# Altium schematic sheet Sensors.SchDoc: Sensor Interfaces
size A4; DocumentNumber: 5; Revision: D; SheetNumber: 5; SheetTotal: 7
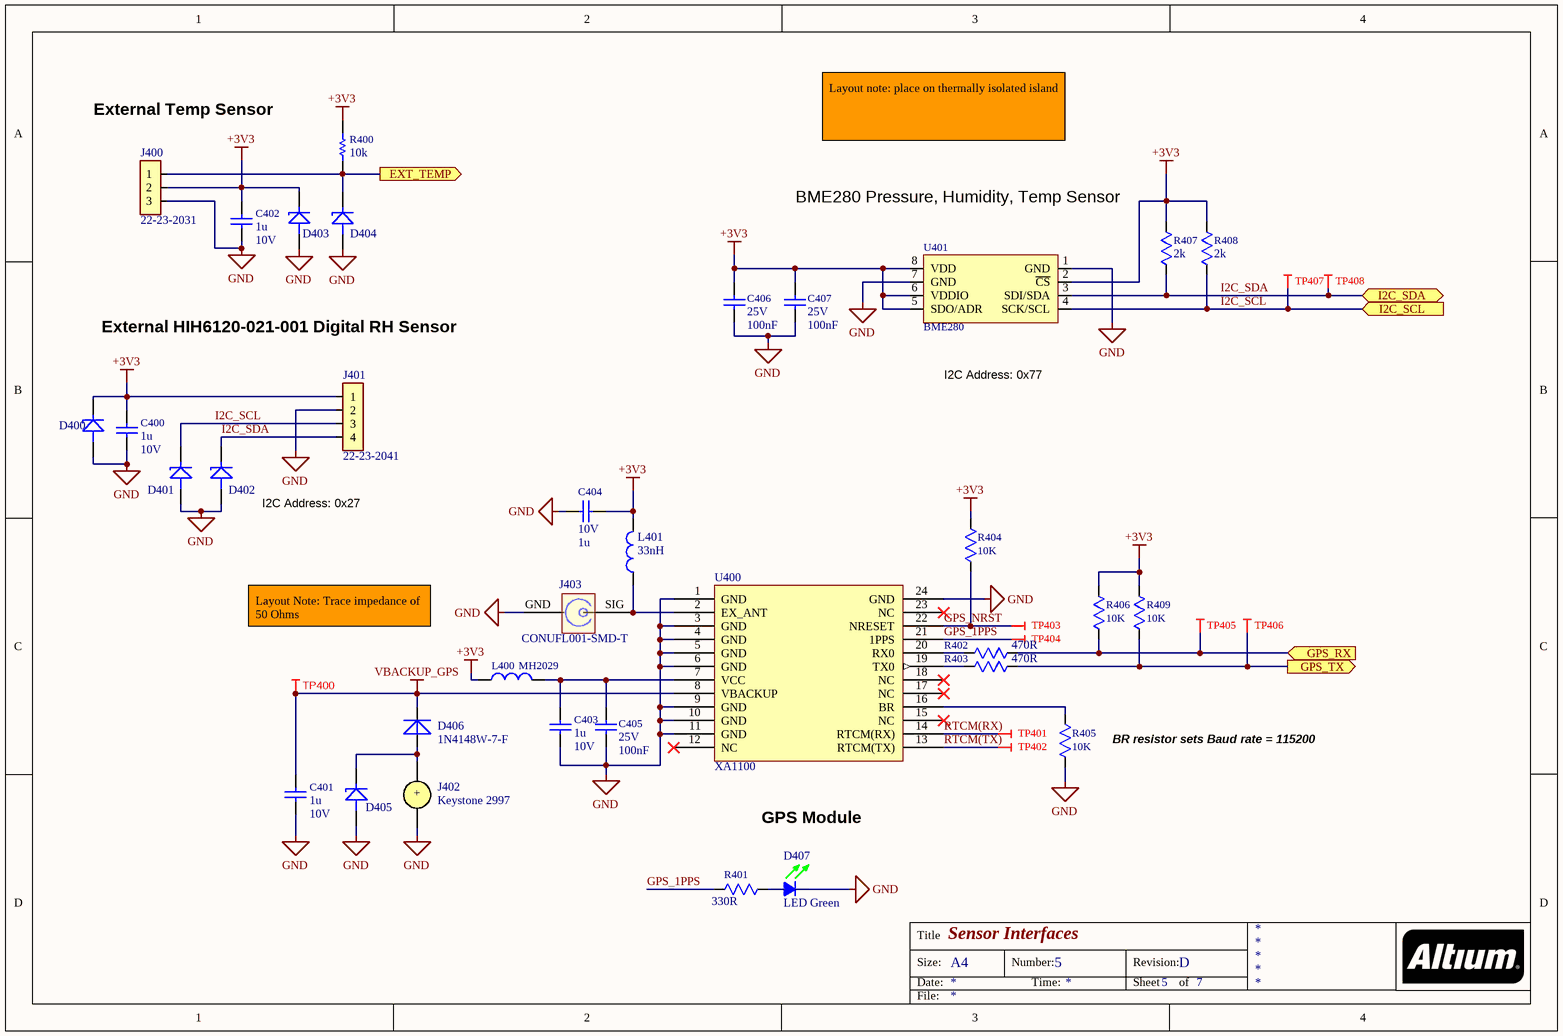
[diagram p0: Sensors.SchDoc]

## Parts
C400  value 1u  Voltage: 10V  [CAPC1005X06N]  (hidden comment: 4.7uF)
C401  value 1u  Voltage: 10V  [CAPC1005X06N]  (hidden comment: 4.7uF)
C402  value 1u  Voltage: 10V  [CAPC1005X06N]  (hidden comment: 4.7uF)
C403  value 1u  Voltage: 10V  [CAPC1005X06N]  (hidden comment: 4.7uF)
C404  value 1u  Voltage: 10V  [CAPC1005X06N]  (hidden comment: 4.7uF)
C405  value 100nF  Voltage: 25V  [CAPC1005X06N]  (hidden comment: 4.7uF)
C406  value 100nF  Voltage: 25V  [CAPC1005X06N]  (hidden comment: 4.7uF)
C407  value 100nF  Voltage: 25V  [CAPC1005X06N]  (hidden comment: 4.7uF)
D400  3.3V TVS  [NXP PTVSxS1UR-Series (SOD123W)]  (value not drawn)
D401  3.3V TVS  [NXP PTVSxS1UR-Series (SOD123W)]  (value not drawn)
D402  3.3V TVS  [NXP PTVSxS1UR-Series (SOD123W)]  (value not drawn)
D403  3.3V TVS  [NXP PTVSxS1UR-Series (SOD123W)]  (value not drawn)
D404  3.3V TVS  [NXP PTVSxS1UR-Series (SOD123W)]  (value not drawn)
D405  3.3V TVS  [NXP PTVSxS1UR-Series (SOD123W)]  (value not drawn)
D406  Manufacturer Part Number: 1N4148W-7-F  [SOD-123FL_TVS]  (hidden comment: 1N4148W-FDICT-ND)
D407  LED Green  [LED_0603]
J400  22-23-2031  [22-23-2031]
J401  22-23-2041  [22-23-2041]
J402  Keystone 2997  [2997 11.6mm COIN CELL]
J403  uFl Connector  [CONUFL001-SMD-T]  (value not drawn)
L400  MH2029  [L2012[0805]]
L401  33nH  [L1608[0603]]
R400  value 10k  [RESC1005X03N]  (hidden comment: RES: GENERAL)
R401  value 330R  [R1608[0603] small]  (hidden comment: 330)
R402  value 470R  [RESC1005X03N]  (hidden comment: 10K)
R403  value 470R  [RESC1005X03N]  (hidden comment: 10K)
R404  10K  [RESC1005X03N]
R405  10K  [RESC1005X03N]
R406  10K  [RESC1005X03N]
R407  value 2k  [R1005[0402]]  (hidden comment: 10K)
R408  value 2k  [R1005[0402]]  (hidden comment: 10K)
R409  10K  [RESC1005X03N]
TP400  PAD  [TP_SMD_39MIL]  (value not drawn)  (no BOM)
TP401  PAD  [TP_SMD_39MIL]  (value not drawn)  (no BOM)
TP402  PAD  [TP_SMD_39MIL]  (value not drawn)  (no BOM)
TP403  PAD  [TP_SMD_39MIL]  (value not drawn)  (no BOM)
TP404  PAD  [TP_SMD_45MIL]  (value not drawn)  (no BOM)
TP405  PAD  [TP_SMD_39MIL]  (value not drawn)  (no BOM)
TP406  PAD  [TP_SMD_39MIL]  (value not drawn)  (no BOM)
TP407  PAD  [TP_SMD_39MIL]  (value not drawn)  (no BOM)
TP408  PAD  [TP_SMD_39MIL]  (value not drawn)  (no BOM)
U400  XA1100  [XA1100]
U401  BME280  [BME280]

## Ports
EXT_TEMP (out), GPS_RX (in), GPS_TX (out), I2C_SCL (in), I2C_SDA (bidir)

## Nets
+3V3: C400.2 C402.2 C404.1 C406.2 C407.2 D400.1 D403.1 J400.2 J401.1 L400.1 L401.2 R400.2 R404.2 R406.2 R407.2 R408.2 R409.2 U401.2(~{CS}) U401.5(SDO/ADR) U401.6(VDDIO) U401.8(VDD)
GND: C400.1 C401.1 C402.1 C403.1 C404.2 C405.1 C406.1 C407.1 D400.2 D401.2 D402.2 D403.2 D404.2 D405.2 D407.2 J400.3 J401.2 J402.2 J403.GND R405.1 U400.1(GND) U400.3(GND) U400.4(GND) U400.5(GND) U400.6(GND) U400.9(GND) U400.10(GND) U400.11(GND) U400.24(GND) U401.1(GND) U401.7(GND)
VBACKUP_GPS: C401.2 D406.2 TP400.1 U400.8(VBACKUP)
EXT_TEMP: D404.1 J400.1 R400.1 ; port EXT_TEMP
GPS_1PPS: R401.2 TP404.1 U400.21(1PPS)
GPS_NRST: R404.1 TP403.1 U400.22(NRESET)
GPS_RX: R402.1 R406.1 TP405.1 ; port GPS_RX
GPS_TX: R403.1 R409.1 TP406.1 ; port GPS_TX
I2C_SCL: D401.1 J401.3 R408.1 TP407.1 U401.4(SCK/SCL) ; port I2C_SCL
I2C_SDA: D402.1 J401.4 R407.1 TP408.1 U401.3(SDI/SDA) ; port I2C_SDA
RTCM(RX): TP401.1 U400.14(RTCM(RX))
RTCM(TX): TP402.1 U400.13(RTCM(TX))
NetC403_2: C403.2 C405.2 L400.2 U400.7(VCC)
NetD405_1: D405.1 D406.1 J402.1(+)
NetD407_1: D407.1 R401.1
NetJ403_SIG: J403.SIG L401.1 U400.2(EX_ANT)
NetR402_2: R402.2 U400.20(RX0)
NetR403_2: R403.2 U400.19(TX0)
NetR405_2: R405.2 U400.16(BR)

Not connected (* = marked no-connect by the designer): U400 12(NC)* 15(NC)* 17(NC)* 18(NC)* 23(NC)*

## Notes on the sheet
- External Temp Sensor
- Layout note: place on thermally isolated island
- BME280 Pressure, Humidity, Temp Sensor
- External HIH6120-021-001 Digital RH Sensor
- I2C Address: 0x77
- I2C Address: 0x27
- Layout Note: Trace impedance of 50 Ohms
- (near R405) BR resistor sets Baud rate = 115200
- GPS Module
- Title
- Size:
- Date:
- A4
- Number:
- Time:
- Revision:
- Sheet
- of
- File:

## Library data of the parts
C400-C404 = 4.7uF_0603_10V: CAP 4.7uF 10V ±10% X5R 0603; Manufacturer Part Number: CL05A105MP5NNNC; Manufacturer: Samsung; ComponentLink1URL: http://www.murata.com/~/media/webrenewal/support/library/catalog/products/capacitor/mlcc/c02e.pdf; ComponentLink1Description: http://www.murata.com/~/media/webrenewal/support/library/catalog/products/capacitor/mlcc/c02e.pdf; Supplier Part Number 1: 1276-1448-1-ND; Supplier 1: Digi-Key
C405-C407 = 4.7uF_0603_10V: Manufacturer Part Number: CL05A104KA5NNNC; Manufacturer: Samsung; ComponentLink1URL: http://www.murata.com/~/media/webrenewal/support/library/catalog/products/capacitor/mlcc/c02e.pdf; ComponentLink1Description: http://www.murata.com/~/media/webrenewal/support/library/catalog/products/capacitor/mlcc/c02e.pdf; Supplier 1: Digi-Key; Supplier Part Number 1: 1276-1043-1-ND
D400-D405 = NXP PTVSxS1UR-Series: Manufacturer: Nexperia; Manufacturer Part Number: PTVS3V3S1UTR,115; Supplier 1: Digi-Key; Supplier Part Number 1: 1727-1416-1-ND
D406 = Diode 300mA Gen Purp: 300mA General Purpose; Manufacturer: Diodes Incorporated; Supplier Part Number 1: 1N4148W-FDICT-ND; Supplier 1: Digi-Key
D407 = Green LED: LED Green Diffused 0603; Manufacturer: Rohm; Manufacturer Part Number: SML-D12M8WT86; TZOA PN: XXX; Intensity: 100 mcd; Forward (Drive) Current: 20 mA; Forward Voltage: 2.2 V; Supplier 1: Digi-Key; Stock 1: 105158; Pricing 1: 1=0.34, 10=0.251, 25=0.1848, 100=0.132, 250=0.0898, 500=0.0792, 1000=0.062 (USD); Color: Green; Dimension: 0603; Lens Type: Diffused; ComponentLink1URL: https://datasheet.ciiva.com/11774/0900766b80df3ada-11774260.pdf; ComponentLink1Description: https://datasheet.ciiva.com/11774/0900766b80df3ada-11774260.pdf; ComponentLink2URL: https://datasheet.ciiva.com/3161/sml-d1-3161419.pdf; ComponentLink2Description: https://datasheet.ciiva.com/3161/sml-d1-3161419.pdf; ComponentLink3URL: https://datasheet.ciiva.com/2110/sml-d1-2110396.pdf; ComponentLink3Description: https://datasheet.ciiva.com/2110/sml-d1-2110396.pdf; ComponentLink4URL: https://datasheet.ciiva.com/2110/sml-d1-2110397.pdf; ComponentLink4Description: https://datasheet.ciiva.com/2110/sml-d1-2110397.pdf; ComponentLink5URL: https://datasheet.ciiva.com/2110/sml-d1-2110398.pdf; ComponentLink5Description: https://datasheet.ciiva.com/2110/sml-d1-2110398.pdf; Supplier Part Number 1: 511-1578-1-ND
J400 = 22-23-2031: Connector Header Through Hole 3 position 0.100" (2.54mm); Manufacturer: Molex; Manufacturer Part Number: 0022232031; Value: *; Supplier Part Number 1: WM4201-ND; Supplier 1: Digi-Key
J401 = 22-23-2041: Connector Header Through Hole 4 position 0.100" (2.54mm); Manufacturer: Molex; Manufacturer Part Number: 0022232041; Value: *; Supplier Part Number 1: WM4202-ND; Supplier 1: Digi-Key
J402 = 30mm Coin Cell Holder: DigiKey # 36-2997-ND; Manufacturer: Keystone Electronics; Manufacturer Part Number: 2997; Supplier 1: Digi-Key; Supplier Part Number 1: 36-2997-ND
J403 = uFl Connector: CONUFL001-SMD-T; Manufacturer: Linx Technologies; Supplier 1: Digi-Key; Manufacturer Part Number: CONUFL001-SMD-T; Supplier Part Number 1: CONUFL001-SMD-TCT-ND
L400 = Ferrite_MH2029_0805: Ferrite,SMD,3A,30Ohm,0805; Manufacturer: Bourns Inc.; Manufacturer Part Number: MH2029-300Y; Filter Type: Power, Signal Line; Number of Lines: 1; Impedance @ Frequency: 30 Ohm @ 100MHz; DC Resistance (DCR) (Max): 25 mOhm; ID: 1851582; Supplier 1: Digi-Key; Supplier Part Number 1: MH2029-300YCT-ND; RoHS: RoHS Compliant; Category: Filters; Stock: 27744; Pricing: 1=0.14, 10=0.087, 25=0.08, 50=0.072, 100=0.0529, 250=0.03844, 500=0.03524, 1000=0.03043 (CAD); Packaging: Cut Tape (CT); Current Rating (Max): 3A; Ratings: -; Operating Temperature: -55°C ~ 125°C; Package / Case: 0805 (2012 Metric); Mounting Type: Surface Mount; Height (Max): 0.043" (1.10mm); Size / Dimension: 0.079" L x 0.047" W (2.00mm x 1.20mm); ComponentLink1URL: http://www.bourns.com/docs/Product-Datasheets/mh.pdf; ComponentLink1Description: http://www.bourns.com/docs/Product-Datasheets/mh.pdf; Supplier 2: Arrow; Supplier Part Number 2: m2dWQtYZmUCQVruAmfTV4mDHm8tZpH9KPPdphe4ib-E; Package Quantity: 1; ComponentLink2URL: https://www.arrow.com/en/products/mh2029-300y/bourns/; ComponentLink2Description: https://www.arrow.com/en/products/mh2029-300y/bourns/
L401 = Inductor_33nH: Fixed Inductor,SMD,33nH,550mA,132mOhmDCR,2.5GHz,0603; Manufacturer: Murata; Manufacturer Part Number: LQW18AN33NJ10D; Value: 33n; Supplier 1: Digi-Key; Supplier Part Number 1: 490-6885-1-ND
R400 = RES: GENERAL: Manufacturer: Panasonic; Manufacturer Part Number: ERJ-2RKF1002X; Accuracy: *; Distributor Part Number: *; Power: *; Type: *; Distributor: Digi-Key; Package: *; Supplier 1: Digi-Key; Supplier Part Number 1: P10.0KLCT-ND
R401 = 1K00_0603_0.1W: RES 1K Ohm ±5%, 0.25W,1/4W 0603; Manufacturer: Rohm; Manufacturer Part Number: RC0603FR-07330RL; Supplier 1: Digi-Key; Resistance (Ohms): 1k; ComponentLink1URL: https://datasheet.ciiva.com/2469/esr-2469603.pdf; ComponentLink1Description: https://datasheet.ciiva.com/2469/esr-2469603.pdf; ComponentLink2URL: https://datasheet.ciiva.com/2469/esr-2469604.pdf; ComponentLink2Description: https://datasheet.ciiva.com/2469/esr-2469604.pdf; ComponentLink3URL: https://datasheet.ciiva.com/2469/esr-2469605.pdf; ComponentLink3Description: https://datasheet.ciiva.com/2469/esr-2469605.pdf; Supplier Part Number 1: 311-330HRCT-ND
R402 R403 = 1K00_0603_0.1W: RES 1K Ohm ±5%, 0.25W,1/4W 0603; Manufacturer: Panasonic; Manufacturer Part Number: ERJ-2RKF4700X; ComponentLink1URL: https://datasheet.ciiva.com/2469/esr-2469603.pdf; ComponentLink1Description: https://datasheet.ciiva.com/2469/esr-2469603.pdf; ComponentLink2URL: https://datasheet.ciiva.com/2469/esr-2469604.pdf; ComponentLink2Description: https://datasheet.ciiva.com/2469/esr-2469604.pdf; ComponentLink3URL: https://datasheet.ciiva.com/2469/esr-2469605.pdf; ComponentLink3Description: https://datasheet.ciiva.com/2469/esr-2469605.pdf; Supplier 1: Digi-Key; Supplier Part Number 1: P470LCT-ND
R404-R406 R409 = 1K00_0603_0.1W: RES 1K Ohm ±5%, 0.25W,1/4W 0603; Manufacturer: Panasonic; Manufacturer Part Number: ERJ-2RKF1002X; ComponentLink1URL: https://datasheet.ciiva.com/2469/esr-2469603.pdf; ComponentLink1Description: https://datasheet.ciiva.com/2469/esr-2469603.pdf; ComponentLink2URL: https://datasheet.ciiva.com/2469/esr-2469604.pdf; ComponentLink2Description: https://datasheet.ciiva.com/2469/esr-2469604.pdf; ComponentLink3URL: https://datasheet.ciiva.com/2469/esr-2469605.pdf; ComponentLink3Description: https://datasheet.ciiva.com/2469/esr-2469605.pdf; Supplier 1: Digi-Key; Supplier Part Number 1: P10.0KLCT-ND; Value: 10k
R407 R408 = 1K00_0603_0.1W: Manufacturer: Panasonic; Manufacturer Part Number: ERJ-2RKF2001X; Supplier 1: Digi-Key; ComponentLink1URL: https://datasheet.ciiva.com/2469/esr-2469603.pdf; ComponentLink1Description: https://datasheet.ciiva.com/2469/esr-2469603.pdf; ComponentLink2URL: https://datasheet.ciiva.com/2469/esr-2469604.pdf; ComponentLink2Description: https://datasheet.ciiva.com/2469/esr-2469604.pdf; ComponentLink3URL: https://datasheet.ciiva.com/2469/esr-2469605.pdf; ComponentLink3Description: https://datasheet.ciiva.com/2469/esr-2469605.pdf; Supplier Part Number 1: P2.00KLDKR-ND
TP400-TP403 TP405-TP408 = TP_SMD_39MIL: SMD Test Pad; Manufacturer: No P/N Required; P/N: No P/N; UM: EA; Fast Supplier: No P/N Required; Fast Supplier P/N: No P/N Required; Manufacturer P/N: No P/N Required
TP404 = TP_SMD_45MIL: SMD Test Pad; Manufacturer: No P/N Required; P/N: No P/N; UM: EA; Fast Supplier: No P/N Required; Fast Supplier P/N: No P/N Required; Manufacturer P/N: No P/N Required
U400 = XA1100: GPS Module; Manufacturer Part Number: XA1100_1103872; Manufacturer: Sierra Wireless; Supplier Part Number 1: 1645-1094-1-ND; Supplier 1: Digi-Key
U401 = BME280: SENSOR Humidity Temperature 0 ~ 100% RH I²C SPI ±3% 1s 8-Pin LGA; Manufacturer: Bosch; Supplier 1: Digi-Key; Manufacturer Part Number: BME280; Supplier Part Number 1: 828-1063-1-ND